# EAGLE design powermeter (EAGLE 7.2.0)
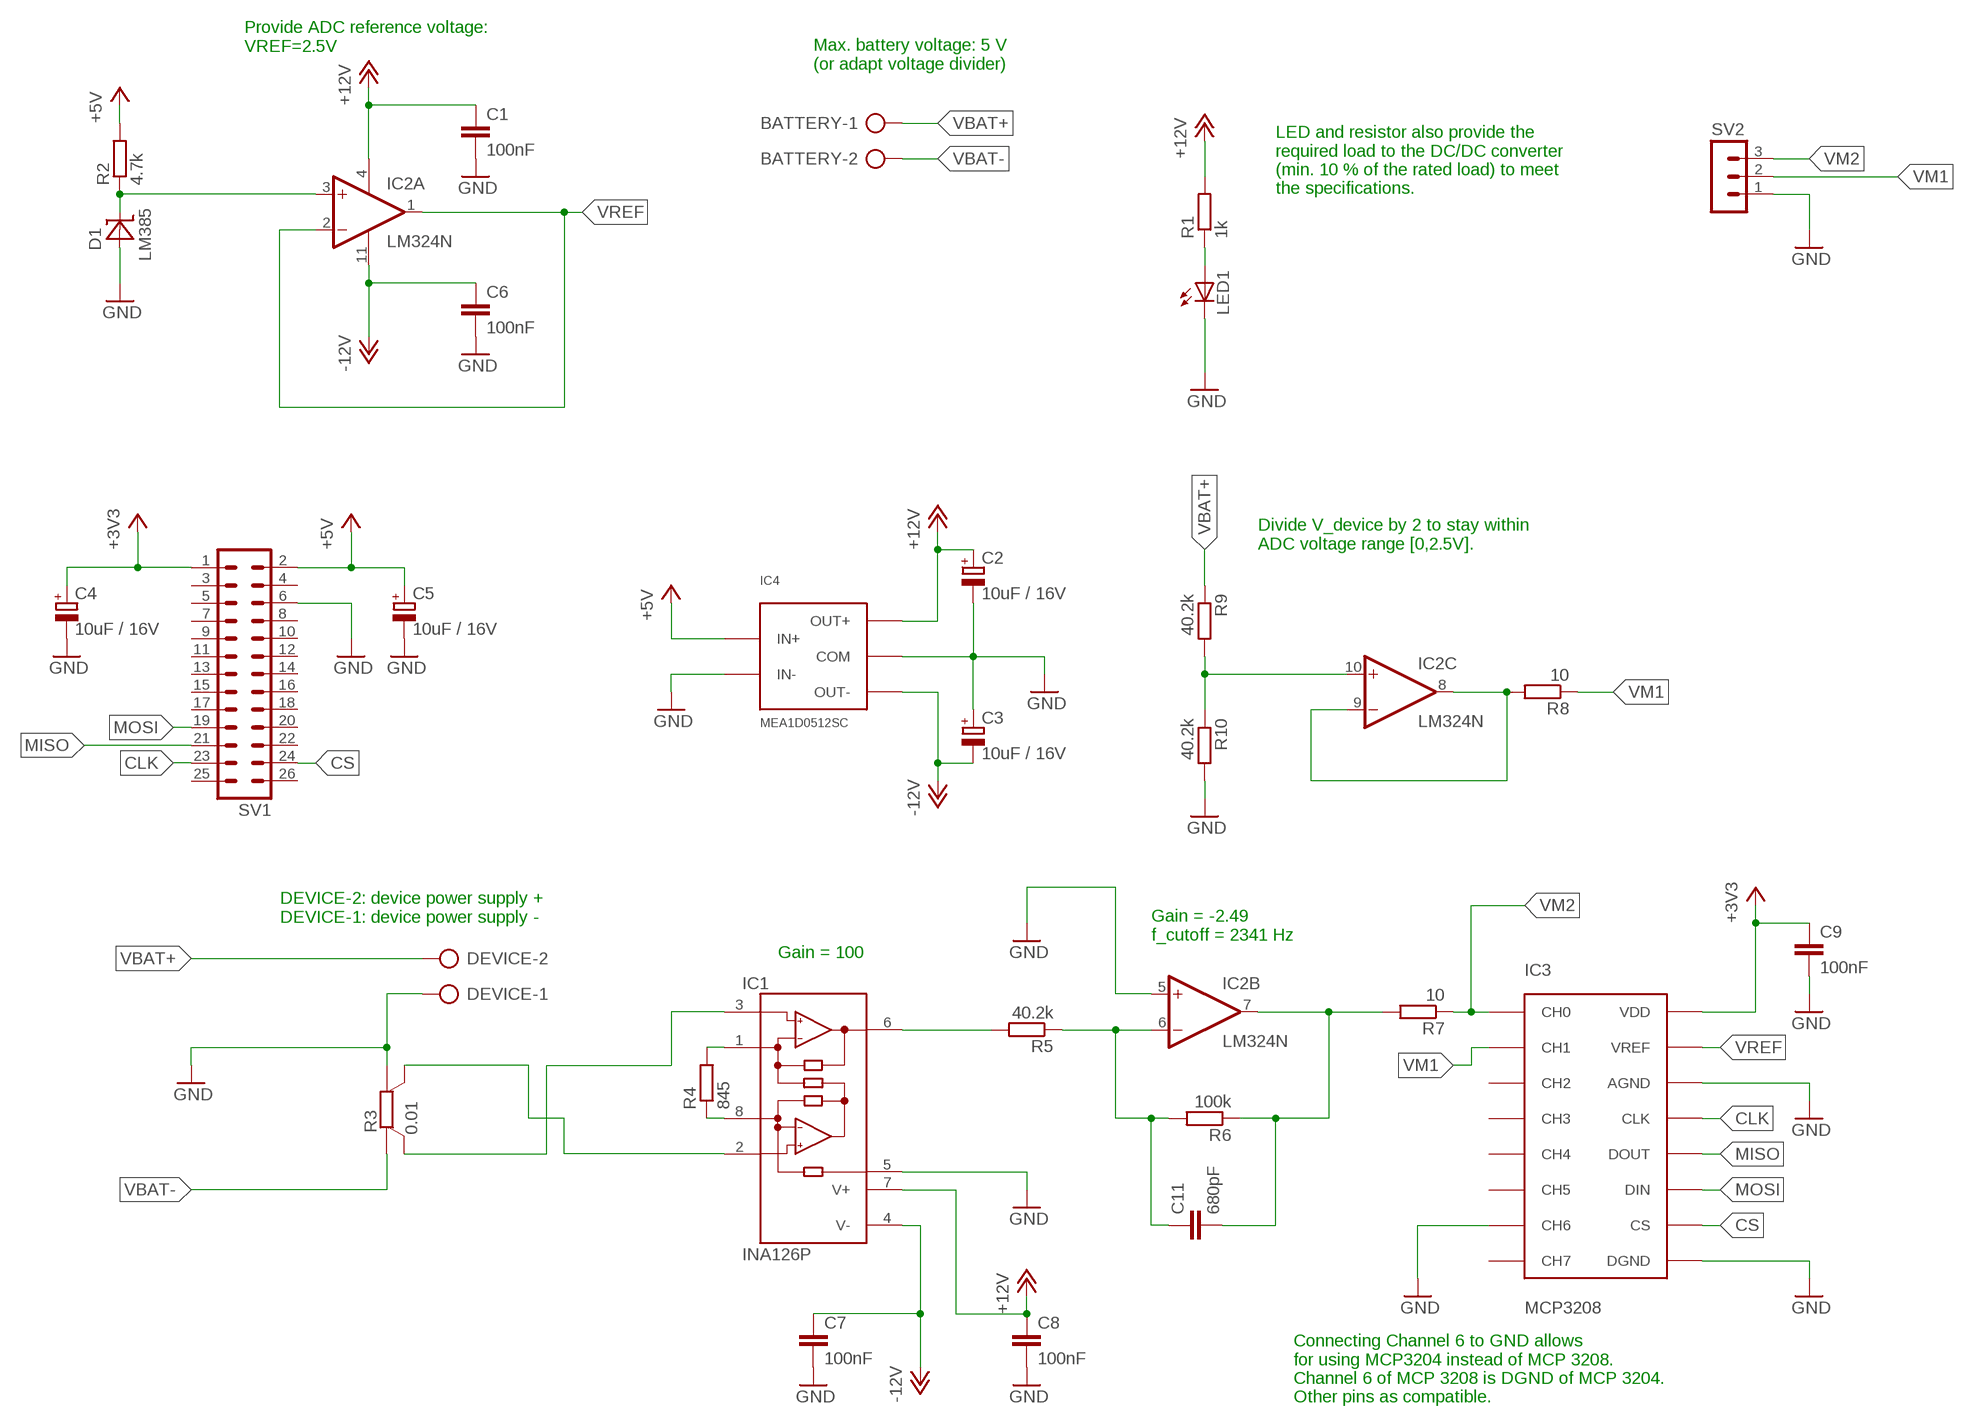
[diagram p0: schematic, sheet 1]

## Parts
BATTERY  AK500/2  [AK500/2]
C1  100nF  C-EU050-024X044  [C050-024X044]
C2  10uF / 16V  CPOL-EUE2.5-6  [E2,5-6]
C3  10uF / 16V  CPOL-EUE2.5-6  [E2,5-6]
C4  10uF / 16V  CPOL-EUE2.5-6  [E2,5-6]
C5  10uF / 16V  CPOL-EUE2.5-6  [E2,5-6]
C6  100nF  C-EU050-024X044  [C050-024X044]
C7  100nF  C-EU050-024X044  [C050-024X044]
C8  100nF  C-EU050-024X044  [C050-024X044]
C9  100nF  C-EU050-024X044  [C050-024X044]
C11  680pF  C-EU050-050X075  [C050-050X075]
D1  LM385  [TO-92]
DEVICE  AK500/2  [AK500/2]
IC1  INA126P  [DIL08]
IC2  LM324N  [DIL14]
IC3  MCP3208  [DIL16]
IC4  MEA1D0512SC  MEA1  [MEA1]
LED1  LED3MM  [LED3MM]
R1  1k  R-EU_0207/7  [0207/7]
R2  4.7k  R-EU_0207/7  [0207/7]
R3  0.01  PBV  [PBV]
R4  845  R-EU_0207/7  [0207/7]
R5  40.2k  R-EU_0207/7  [0207/7]
R6  100k  R-EU_0207/7  [0207/7]
R7  10  R-EU_0207/7  [0207/7]
R8  10  R-EU_0207/7  [0207/7]
R9  40.2k  R-EU_0207/7  [0207/7]
R10  40.2k  R-EU_0207/7  [0207/7]
SV1  ML26  [ML26]
SV2  MA03-1  [MA03-1]

## Nets
+3V3: C4.+ C9.1 IC3.VDD SV1.1
+5V: C5.+ IC4.P$IN+(IN+) R2.2 SV1.2
+12V: C1.1 C2.+ C8.1 IC1.7(V+) IC2.4(P:V+) IC4.P$OUT+(OUT+) R1.2
-12V: C3.- C6.1 C7.1 IC1.4(V-) IC2.11(P:V-) IC4.P$OUT-(OUT-)
CLK: IC3.CLK SV1.23
CS: IC3.CS SV1.24
GND: C1.2 C2.- C3.+ C4.- C5.- C6.2 C7.2 C8.2 C9.2 D1.+ DEVICE.1 IC1.5(REF) IC2.5(B:+IN) IC3.AGND IC3.CH6 IC3.DGND IC4.P$COM(COM) IC4.P$IN-(IN-) LED1.K(C) R3.P$A(A) R10.2 SV1.6 SV2.1
MISO: IC3.DOUT SV1.21
MOSI: IC3.DIN SV1.19
N$2: IC1.1(RG) R4.2
N$3: IC1.8(RG) R4.1
N$4: IC1.3(+IN) R3.P$SB(SB)
N$6: C11.2 IC2.7(B:OUT) R6.1 R7.2
N$7: C11.1 IC2.6(B:-IN) R5.1 R6.2
N$8: IC1.6(OUT) R5.2
N$9: IC2.10(C:+IN) R9.2 R10.1
N$11: LED1.A R1.1
N$12: IC1.2(-IN) R3.P$SA(SA)
N$13: IC2.8(C:OUT) IC2.9(C:-IN) R8.2
N$14: D1.- IC2.3(A:+IN) R2.1
VBAT+: BATTERY.1 DEVICE.2 R9.1
VBAT-: BATTERY.2 R3.P$B(B)
VM1: IC3.CH1 R8.1 SV2.2
VM2: IC3.CH0 R7.1 SV2.3
VREF: IC2.1(A:OUT) IC2.2(A:-IN) IC3.VREF
Unconnected: IC2.12(D:+IN) IC2.13(D:-IN) IC2.14(D:OUT) IC3.CH2 IC3.CH3 IC3.CH4 IC3.CH5 IC3.CH7 SV1.3 SV1.4 SV1.5 SV1.7 SV1.8 SV1.9 SV1.10 SV1.11 SV1.12 SV1.13 SV1.14 SV1.15 SV1.16 SV1.17 SV1.18 SV1.20 SV1.22 SV1.25 SV1.26

## Notes on the sheet
- Provide ADC reference voltage:
  VREF=2.5V
- Max. battery voltage: 5 V
  (or adapt voltage divider)
- LED and resistor also provide the
  required load to the DC/DC converter
  (min. 10 % of the rated load) to meet
  the specifications.
- Divide V_device by 2 to stay within
  ADC voltage range [0,2.5V].
- DEVICE-2: device power supply +
  DEVICE-1: device power supply -
- Gain = -2.49
  f_cutoff = 2341 Hz
- Gain = 100
- Connecting Channel 6 to GND allows
  for using MCP3204 instead of MCP 3208.
  Channel 6 of MCP 3208 is DGND of MCP 3204.
  Other pins as compatible.

## Library data of the parts
BATTERY DEVICE = con-ptr500:AK500/2: CONNECTOR; OC_FARNELL: unknown; OC_NEWARK: unknown
C1 C6-C9 C11 = rcl:C-EU: CAPACITOR, European symbol
C2-C5 = rcl:CPOL-EU: POLARIZED CAPACITOR, European symbol
D1 = lm385:LM385: LM385 LM385 Micropower Voltage Reference
IC1 = burr-brown:INA126: Instrumentation Amplifier Micropower, Single and Dual Versions; MF: TEXAS INSTRUMENT CONNECTORS; MPN: INA126P; OC_FARNELL: 1509595; OC_NEWARK: 74C9780
IC2 = linear:LM324: OP AMP
IC3 = mcp3208:MCP3208
IC4 = mea1:MEA1
LED1 = led:LED: LED OSRAM: - CHIPLED LG R971, LG N971, LY N971, LG Q971, LY Q971, LO R971, LY R971 LH N974, LH R974 LS Q976, LO Q976, LY Q976 LO Q996 - Hyper CHIPLED LW Q18S LB Q993, LB Q99A, LB R99A - SideLED LS A670, LO A670, LY A670, LG A670, LP A670 LB A673, LV A673, LT A673, LW A673 LH A674 LY A675 LS A676, LA A676, LO A676, LY A676, LW A676 LS A679, LY A679, LG A679 - Hyper Micro SIDELED® LS Y876, LA Y876, LO Y876, LY Y876 LT Y87S - SmartLED LW L88C, LW L88S LB L89C, LB L89S, LG L890 LS L89K, LO L89K, LY L89K LS L896, LA L896, LO L896, LY L896 - TOPLED LS T670, LO T670, LY T670, LG T670, LP T670 LSG T670, LSP T670, LSY T670, LOP T670, LYG T670 LG T671, LOG T671, LSG T671 LB T673, LV T673, LT T673, LW T673 LH T674 LS T676, LA T676, LO T676, LY T676, LB T676, LH T676, LSB T676, LW T676 LB T67C, LV T67C, LT T67C, LS T67K, LO T67K, LY T67K, LW E67C LS E67B, LA E67B, LO E67B, LY E67B, LB E67C, LV E67C, LT E67C LW T67C LS T679, LY T679, LG T679 LS T770, LO T770, LY T770, LG T770, LP T770 LB T773, LV T773, LT T773, LW T773 LH T774 LS E675, LA E675, LY E675, LS T675 LS T776, LA T776, LO T776, LY T776, LB T776 LHGB T686 LT T68C, LB T68C - Hyper Mini TOPLED® LB M676 - Mini TOPLED Santana® LG M470 LS M47K, LO M47K, LY M47K Source: http://www.osram.convergy.de LUXEON: - LUMILED® LXK2-PW12-R00, LXK2-PW12-S00, LXK2-PW14-U00, LXK2-PW14-V00 LXK2-PM12-R00, LXK2-PM12-S00, LXK2-PM14-U00 LXK2-PE12-Q00, LXK2-PE12-R00, LXK2-PE12-S00, LXK2-PE14-T00, LXK2-PE14-U00 LXK2-PB12-K00, LXK2-PB12-L00, LXK2-PB12-M00, LXK2-PB14-N00, LXK2-PB14-P00, LXK2-PB14-Q00 LXK2-PR12-L00, LXK2-PR12-M00, LXK2-PR14-Q00, LXK2-PR14-R00 LXK2-PD12-Q00, LXK2-PD12-R00, LXK2-PD12-S00 LXK2-PH12-R00, LXK2-PH12-S00 LXK2-PL12-P00, LXK2-PL12-Q00, LXK2-PL12-R00 Source: www.luxeon.com KINGBRIGHT: KA-3528ASYC Source: www.kingbright.com
R1 R2 R4-R10 = rcl:R-EU_: RESISTOR, European symbol
R3 = pbv:PBV
SV1 = con-harting-ml:ML26: HARTING; OC_FARNELL: unknown; OC_NEWARK: unknown
SV2 = con-lstb:MA03-1: PIN HEADER; OC_FARNELL: unknown; OC_NEWARK: unknown

## Board
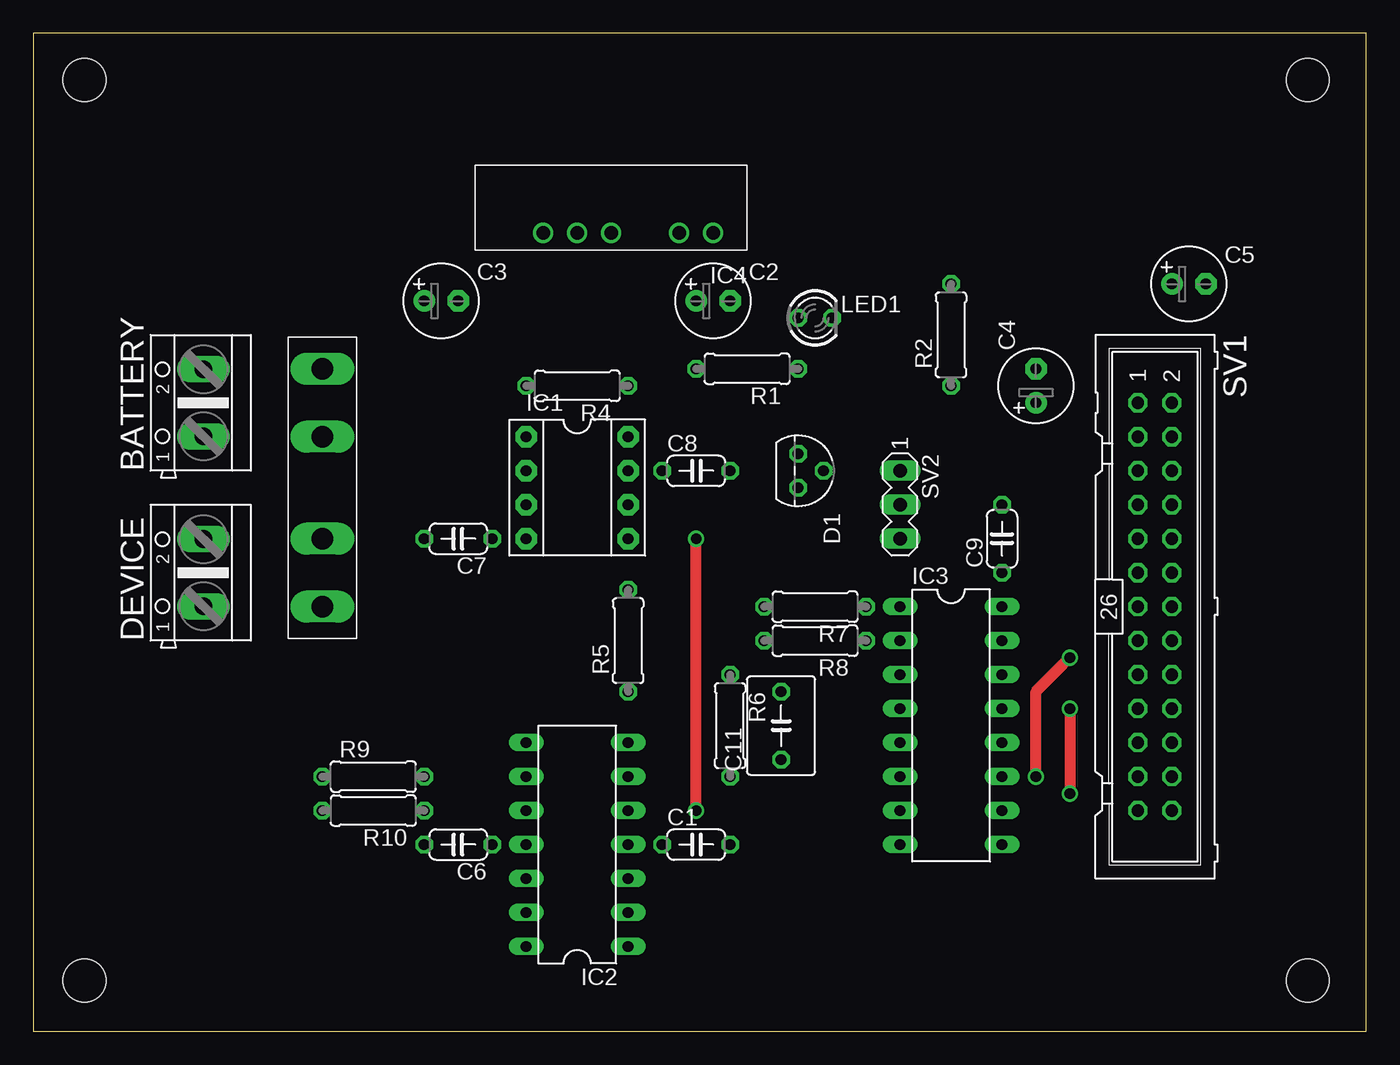
[diagram p1: board, top side]
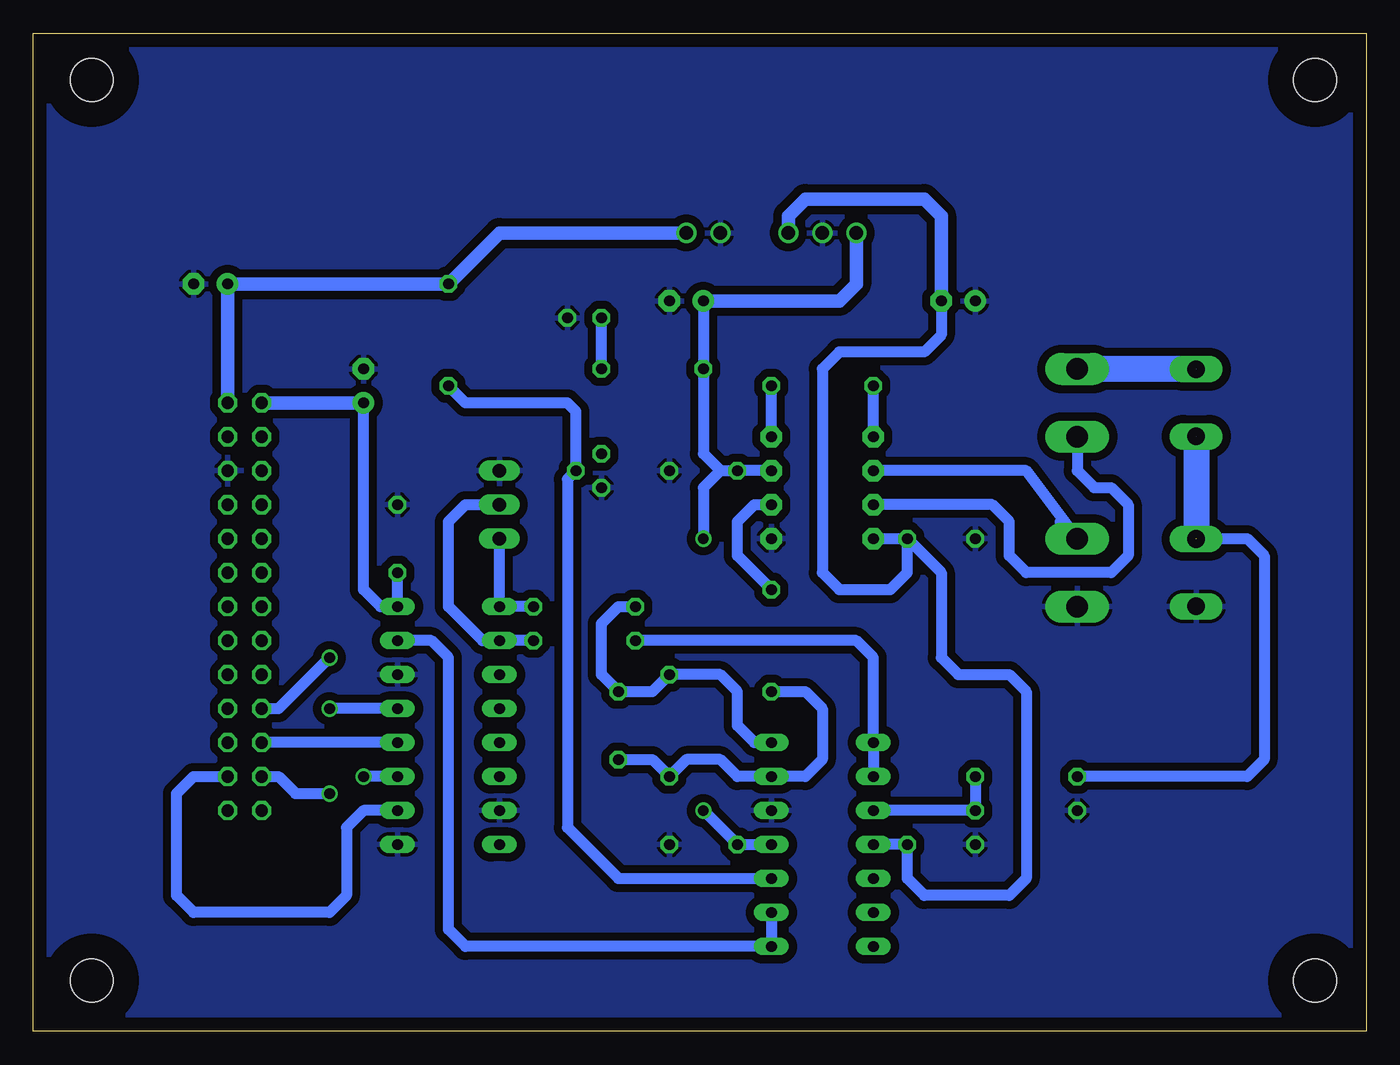
[diagram p2: board, bottom side, seen from below]

Size 99.6 x 74.6 mm. Coordinates in mm from the lower left corner, seen from the top.
Outline: 0,0 99.6,0 99.6,74.6 0,74.6 0,0
Copper layers (1*16): Top 0.035mm / dielectric 1.5mm / Bottom 0.035mm
Design rules "default *": minimum track width 10mil, minimum drill 24mil, track to track 24mil, track to pad 24mil, pad to pad 24mil, via to via 24mil, smd to smd 8mil, copper to edge 40mil, drill to drill 8mil, minimum pad ring 10mil, minimum via ring 8mil, stop-mask expansion 4mil, vias tented up to drill 0mil, thermal gap 10mil
Holes 3.2 mm at 3.81,3.81 3.81,71.12 95.25,3.81 95.25,71.12
bRestrict: area 0.3,67.6 to 7.3,74.6; area 91.8,67.6 to 98.8,74.6; area 91.8,0.3 to 98.8,7.3; area 0.3,0.3 to 7.3,7.3

### Footprints (pad centres in the part's own frame; a part is rotated, then mirrored left to right if it is on the bottom)
AK500/2 = drill 1.321 long: 1 -2.515,0; 2 2.515,0
C050-024X044 = drill 0.813 octagon: 1 -2.54,0; 2 2.54,0
E2,5-6 = drill 0.813 pad 1.6: + -1.27,0 | drill 0.813 pad 1.6 octagon: - 1.27,0
C050-050X075 = drill 0.813 octagon: 1 -2.54,0; 2 2.54,0
TO-92 = drill 0.813 octagon: + 1.27,0; - 0,1.905; NC -1.27,0
DIL08 = drill 0.813 pad 1.6 octagon: 1 -3.81,-3.81; 2 -1.27,-3.81; 3 1.27,-3.81; 4 3.81,-3.81; 5 3.81,3.81; 6 1.27,3.81; 7 -1.27,3.81; 8 -3.81,3.81
DIL14 = drill 0.813 long: 1 -7.62,-3.81; 2 -5.08,-3.81; 3 -2.54,-3.81; 4 0,-3.81; 5 2.54,-3.81; 6 5.08,-3.81; 7 7.62,-3.81; 8 7.62,3.81; 9 5.08,3.81; 10 2.54,3.81; 11 0,3.81; 12 -2.54,3.81; 13 -5.08,3.81; 14 -7.62,3.81
DIL16 = drill 0.813 long: AGND -3.81,3.81; CH0 -8.89,-3.81; CH1 -6.35,-3.81; CH2 -3.81,-3.81; CH3 -1.27,-3.81; CH4 1.27,-3.81; CH5 3.81,-3.81; CH6 6.35,-3.81; CH7 8.89,-3.81; CLK -1.27,3.81; CS 6.35,3.81; DGND 8.89,3.81; DIN 3.81,3.81; DOUT 1.27,3.81; VDD -8.89,3.81; VREF -6.35,3.81
MEA1 = drill 1: P$COM 2.54,0; P$IN+ -7.62,0; P$IN- -5.08,0; P$OUT+ 5.08,0; P$OUT- 0,0
LED3MM = drill 0.813 octagon: A -1.27,0; K 1.27,0
0207/7 = drill 0.813 octagon: 1 -3.81,0; 2 3.81,0
PBV = drill 1.6 long: P$A -8.89,0; P$B 8.89,0; P$SA -3.81,0; P$SB 3.81,0
ML26 = drill 0.914 octagon: 1 -15.24,-1.27; 2 -15.24,1.27; 3 -12.7,-1.27; 4 -12.7,1.27; 5 -10.16,-1.27; 6 -10.16,1.27; 7 -7.62,-1.27; 8 -7.62,1.27; 9 -5.08,-1.27; 10 -5.08,1.27; 11 -2.54,-1.27; 12 -2.54,1.27; 13 0,-1.27; 14 0,1.27; 15 2.54,-1.27; 16 2.54,1.27; 17 5.08,-1.27; 18 5.08,1.27; 19 7.62,-1.27; 20 7.62,1.27; 21 10.16,-1.27; 22 10.16,1.27; 23 12.7,-1.27; 24 12.7,1.27; 25 15.24,-1.27; 26 15.24,1.27
MA03-1 = drill 1.016 long: 1 -2.54,0; 2 0,0; 3 2.54,0

### Placement (x,y rotation side)
BATTERY  12.7,46.99 90 top
C1  49.53,13.97 0 top
C2  50.8,54.61 0 top
C3  30.48,54.61 0 top
C4  74.93,48.26 90 top
C5  86.36,55.88 0 top
C6  31.75,13.97 180 top
C7  31.75,36.83 180 top
C8  49.53,41.91 0 top
C9  72.39,36.83 90 top
C11  55.88,22.86 90 top
D1  57.15,41.91 270 top
DEVICE  12.7,34.29 90 top
IC1  40.64,40.64 270 top
IC2  40.64,13.97 90 top
IC3  68.58,22.86 270 top
IC4  43.18,59.69 180 top
LED1  58.42,53.34 0 top
R1  53.34,49.53 180 top
R2  68.58,52.07 90 top
R3  21.59,40.64 90 top
R4  40.64,48.26 180 top
R5  44.45,29.21 90 top
R6  52.07,22.86 270 top
R7  58.42,31.75 180 top
R8  58.42,29.21 180 top
R9  25.4,19.05 0 top
R10  25.4,16.51 180 top
SV1  83.82,31.75 270 top
SV2  64.77,39.37 270 top

### Tracks (layer width: path | path; a pad name or v marks a point on that pad's centre or on a via)
+3V3
  Bottom 0.813: C9.1 IC3.VDD 73.66,31.75 74.93,33.02 C4.+
  Bottom 1.016: SV1.1 C4.+
+5V
  Bottom 1.016: SV1.2 C5.+ R2.2 64.77,59.69 IC4.P$IN+
+12V  (via drill 0.8)
  Top 0.813: v49.53,16.51 v49.53,36.83
  Bottom 0.813: IC1.7 C8.1 48.26,41.91 | IC2.4 C1.1 v49.53,16.51 | 48.26,41.91 49.53,43.18 R1.2 C2.+ | 48.26,41.91 49.53,40.64 v49.53,36.83
  Bottom 1.016: IC4.P$OUT+ 38.1,55.88 39.37,54.61 C2.+
-12V
  Bottom 0.813: IC1.4 C7.1 | C7.1 31.75,34.29 31.75,27.94 30.48,26.67 26.67,26.67 25.4,25.4 25.4,11.43 26.67,10.16 33.02,10.16 34.29,11.43 C6.1 IC2.11 | C3.- 31.75,52.07 33.02,50.8 39.37,50.8 40.64,49.53 40.64,34.29 39.37,33.02 35.56,33.02 34.29,34.29 C7.1
  Bottom 1.016: IC4.P$OUT- 43.18,60.96 41.91,62.23 33.02,62.23 31.75,60.96 C3.-
CLK  (via drill 0.8)
  Top 0.813: v77.47,24.13 v77.47,17.78
  Bottom 0.813: SV1.23 81.28,19.05 80.01,17.78 v77.47,17.78 | IC3.CLK v77.47,24.13
CS
  Bottom 0.813: IC3.CS 74.93,16.51 76.2,15.24 76.2,10.16 77.47,8.89 87.63,8.89 88.9,10.16 88.9,17.78 87.63,19.05 SV1.24
GND
  pour Bottom: -3.81,77.47 102.87,77.47 102.87,-2.54 -3.81,-2.54
MISO
  Bottom 0.813: IC3.DOUT SV1.21
MOSI  (via drill 0.8)
  Top 0.813: v74.93,19.05 74.93,25.4 v77.47,27.94
  Bottom 0.813: IC3.DIN v74.93,19.05 | SV1.19 81.28,24.13 v77.47,27.94
N$2
  Bottom 0.813: IC1.1 R4.2
N$3
  Bottom 0.813: IC1.8 R4.1
N$4
  Bottom 0.813: R3.P$SB 21.59,41.91 20.32,40.64 19.05,40.64 17.78,39.37 17.78,35.56 19.05,34.29 25.4,34.29 26.67,35.56 26.67,38.1 27.94,39.37 IC1.3
N$6
  Bottom 0.813: R7.2 55.88,31.75 57.15,30.48 57.15,26.67 C11.2 53.34,25.4 R6.1 48.26,26.67 46.99,25.4 46.99,22.86 45.72,21.59 IC2.7
N$7
  Bottom 0.813: C11.1 53.34,20.32 R6.2 50.8,20.32 48.26,20.32 46.99,19.05 IC2.6 41.91,19.05 40.64,20.32 40.64,24.13 41.91,25.4 R5.1
N$8
  Bottom 0.813: R5.2 46.99,35.56 46.99,38.1 45.72,39.37 IC1.6
N$9
  Bottom 0.813: R9.2 R10.1 IC2.10
N$11
  Bottom 0.813: R1.1 LED1.A
N$12
  Bottom 0.813: 22.86,38.1 R3.P$SA 25.4,41.91 IC1.2
N$13
  Bottom 0.813: R8.2 38.1,29.21 36.83,27.94 IC2.8 IC2.9
N$14
  Bottom 0.813: IC2.3 55.88,11.43 59.69,15.24 59.69,41.27 D1.- 59.05,46.35 59.69,46.99 67.31,46.99 R2.1
VBAT+  (2 unrouted)
  Bottom 0.813: 12.7,36.83 8.89,36.83 7.62,35.56 7.62,20.32 8.89,19.05 R9.1
  Bottom 1.93: 12.7,44.45 12.7,36.83
VBAT-  (1 unrouted)
  Bottom 1.93: 12.7,49.53 R3.P$B
VM1
  Bottom 0.813: R8.1 IC3.CH1 66.04,29.21 68.58,31.75 68.58,38.1 67.31,39.37 SV2.2
VM2
  Bottom 0.813: R7.1 IC3.CH0 SV2.3
VREF
  Bottom 0.813: IC2.2 IC2.1 67.31,6.35 68.58,7.62 68.58,27.94 69.85,29.21 IC3.VREF